# Altium schematic sheet pcuPL.SchDoc
size A4
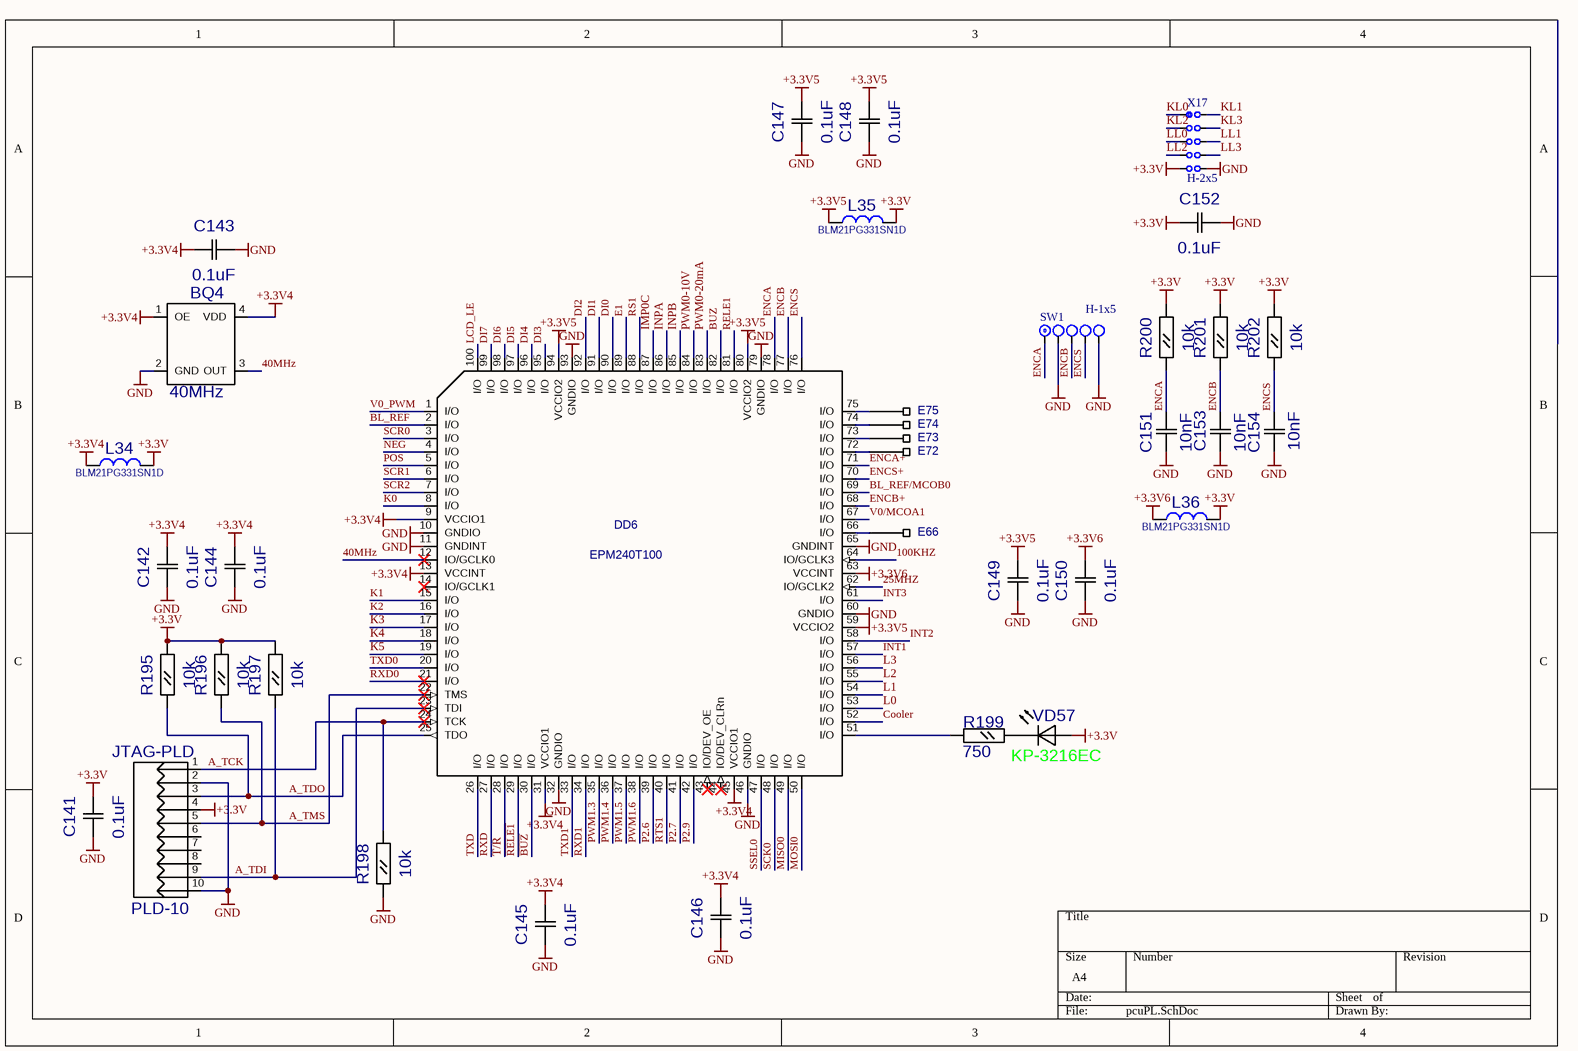
[diagram p0: pcuPL.SchDoc]

## Parts
BQ4  40MHz  [3225]
C141  value 0.1uF  [C0805]  (hidden comment: C0805)
C142  value 0.1uF  [C0805]  (hidden comment: C0805)
C143  value 0.1uF  [C0805]  (hidden comment: C0805)
C144  value 0.1uF  [C0805]  (hidden comment: C0805)
C145  value 0.1uF  [C0805]  (hidden comment: C0805)
C146  value 0.1uF  [C0805]  (hidden comment: C0805)
C147  value 0.1uF  [C0805]  (hidden comment: C0805)
C148  value 0.1uF  [C0805]  (hidden comment: C0805)
C149  value 0.1uF  [C0805]  (hidden comment: C0805)
C150  value 0.1uF  [C0805]  (hidden comment: C0805)
C151  value 10nF  [C0805]  (hidden comment: C0805)
C152  value 0.1uF  [C0805]  (hidden comment: C0805)
C153  value 10nF  [C0805]  (hidden comment: C0805)
C154  value 10nF  [C0805]  (hidden comment: C0805)
DD6  EPM240T100  [QFP100-0.5MM]
E66  PCB_1R  [PCB_1R_Oval]  (value not drawn)
E72  PCB_1R  [PCB_1R_Oval]  (value not drawn)
E73  PCB_1R  [PCB_1R_Oval]  (value not drawn)
E74  PCB_1R  [PCB_1R_Oval]  (value not drawn)
E75  PCB_1R  [PCB_1R_Oval]  (value not drawn)
JTAG-PLD  PLD-10  [HR-2x5L]
L34  BLM21PG331SN1D  [R0805]
L35  BLM21PG331SN1D  [R0805]
L36  BLM21PG331SN1D  [R0805]
R195  value 10k  [R0805]  (hidden comment: R0805)
R196  value 10k  [R0805]  (hidden comment: R0805)
R197  value 10k  [R0805]  (hidden comment: R0805)
R198  value 10k  [R0805]  (hidden comment: R0805)
R199  value 750  [R0805]  (hidden comment: R0805)
R200  value 10k  [R0805]  (hidden comment: R0805)
R201  value 10k  [R0805]  (hidden comment: R0805)
R202  value 10k  [R0805]  (hidden comment: R0805)
SW1  H-1x5  [J1x5]
VD57  KP-3216EC  [KP-3216]
X17  H-2x5  [J2x5]

## Nets
+3.3V: C141.2 C152.2 JTAG-PLD.4 L34.2 L35.2 L36.2 R195.1 R196.1 R197.1 R200.1 R201.1 R202.1 VD57.1 X17.9
+3.3V4: BQ4.1(OE) BQ4.4(VDD) C142.2 C143.2 C144.2 C145.2 C146.2 DD6.9(VCCIO1) DD6.13(VCCINT) DD6.31(VCCIO1) DD6.45(VCCIO1) L34.1
+3.3V5: C147.2 C148.2 C149.2 DD6.59(VCCIO2) DD6.80(VCCIO2) DD6.94(VCCIO2) L35.1
+3.3V6: C150.2 DD6.63(VCCINT) L36.1
GND: BQ4.2(GND) C141.1 C142.1 C143.1 C144.1 C145.1 C146.1 C147.1 C148.1 C149.1 C150.1 C151.1 C152.1 C153.1 C154.1 DD6.10(GNDIO) DD6.11(GNDINT) DD6.32(GNDIO) DD6.46(GNDIO) DD6.60(GNDIO) DD6.65(GNDINT) DD6.79(GNDIO) DD6.93(GNDIO) JTAG-PLD.2 JTAG-PLD.10 R198.2 SW1.2 SW1.5 X17.10
25MHZ: DD6.62(IO/GCLK2)
40MHz: BQ4.3(OUT) DD6.12(IO/GCLK0)
100KHZ: DD6.64(IO/GCLK3)
~{BUZ}: DD6.30(I/O)
~{RELE1}: DD6.29(I/O)
A_TCK: DD6.24(TCK) JTAG-PLD.1 R198.1
A_TDI: DD6.23(TDI) JTAG-PLD.9 R197.2
A_TDO: DD6.25(TDO) JTAG-PLD.3 R195.2
A_TMS: DD6.22(TMS) JTAG-PLD.5 R196.2
BL_REF: DD6.2(I/O)
BL_REF/MCOB0: DD6.69(I/O)
BUZ: DD6.82(I/O)
Cooler: DD6.52(I/O)
DI0: DD6.90(I/O)
DI1: DD6.91(I/O)
DI2: DD6.92(I/O)
DI3: DD6.95(I/O)
DI4: DD6.96(I/O)
DI5: DD6.97(I/O)
DI6: DD6.98(I/O)
DI7: DD6.99(I/O)
E1: DD6.89(I/O)
ENCA: C151.2 DD6.78(I/O) R200.2 SW1.1
ENCA+: DD6.71(I/O)
ENCB: C153.2 DD6.77(I/O) R201.2 SW1.3
ENCB+: DD6.68(I/O)
ENCS: C154.2 DD6.76(I/O) R202.2 SW1.4
ENCS+: DD6.70(I/O)
IMP0C: DD6.87(I/O)
INPA: DD6.86(I/O)
INPB: DD6.85(I/O)
INT1: DD6.57(I/O)
INT2: DD6.58(I/O)
INT3: DD6.61(I/O)
K0: DD6.8(I/O)
K1: DD6.15(I/O)
K2: DD6.16(I/O)
K3: DD6.17(I/O)
K4: DD6.18(I/O)
K5: DD6.19(I/O)
KL0: X17.1
KL1: X17.2
KL2: X17.3
KL3: X17.4
L0: DD6.53(I/O)
L1: DD6.54(I/O)
L2: DD6.55(I/O)
L3: DD6.56(I/O)
LCD_LE: DD6.100(I/O)
LL0: X17.5
LL1: X17.6
LL2: X17.7
LL3: X17.8
MISO0: DD6.49(I/O)
MOSI0: DD6.50(I/O)
NEG: DD6.4(I/O)
P2.6: DD6.39(I/O)
P2.7: DD6.41(I/O)
P2.9: DD6.42(I/O)
POS: DD6.5(I/O)
PWM0-10V: DD6.84(I/O)
PWM0-20mA: DD6.83(I/O)
PWM1.3: DD6.35(I/O)
PWM1.4: DD6.36(I/O)
PWM1.5: DD6.37(I/O)
PWM1.6: DD6.38(I/O)
RELE1: DD6.81(I/O)
RS1: DD6.88(I/O)
RTS1: DD6.40(I/O)
RXD: DD6.27(I/O)
RXD0: DD6.21(I/O)
RXD1: DD6.34(I/O)
SCK0: DD6.48(I/O)
SCR0: DD6.3(I/O)
SCR1: DD6.6(I/O)
SCR2: DD6.7(I/O)
SSEL0: DD6.47(I/O)
~{T}/R: DD6.28(I/O)
TXD: DD6.26(I/O)
TXD0: DD6.20(I/O)
TXD1: DD6.33(I/O)
V0/MCOA1: DD6.67(I/O)
V0_PWM: DD6.1(I/O)
NetDD6_51: DD6.51(I/O) R199.1
NetDD6_66: DD6.66(I/O) E66.1
NetDD6_72: DD6.72(I/O) E72.1
NetDD6_73: DD6.73(I/O) E73.1
NetDD6_74: DD6.74(I/O) E74.1
NetDD6_75: DD6.75(I/O) E75.1
NetR199_2: R199.2 VD57.2

Not connected (* = marked no-connect by the designer): DD6 14(IO/GCLK1)* 43(IO/DEV_OE)* 44(IO/DEV_CLRn)*; JTAG-PLD 6 7 8

## Library data of the parts
BQ4 = OSC: Value: 40MHz
C141-C154 = C0805: RefDes2: {RefDes2}
JTAG-PLD = PLD-10: Value: jtag; RefDes2: {RefDes2}
L34-L36 = BLM21PG331SN1D: Ferrite beads; Value: BLM21PG331SN1D
R195-R202 = R0805: RefDes2: {RefDes2}
VD57 = KP-3216EC: RefDes2: {RefDes2}
SW1 = H-1x5: Price: 0.05
X17 = H-2x5: Price: 0.010